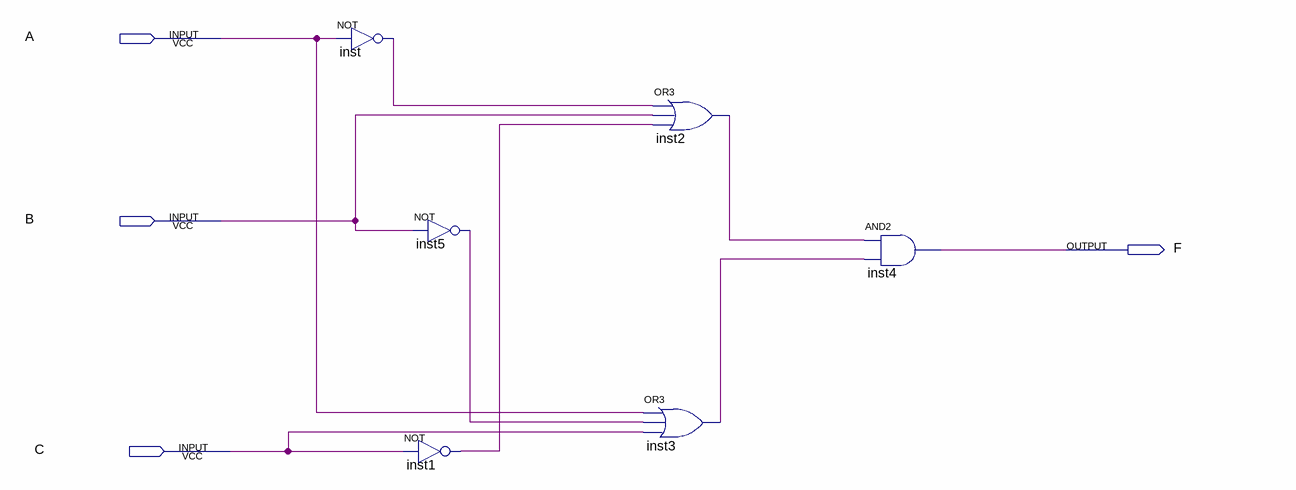
[diagram p0: schematic sheet]
// Quartus schematic lab3step0.bdf as structural Verilog: 6 symbols, 4 pins
module lab3step0 (
  input  A,
  input  B,
  input  C,
  output F
);

  wire inst1_out, inst2_out, inst3_out, inst5_out, inst_out;

  not inst (inst_out, A);
  not inst5 (inst5_out, B);
  not inst1 (inst1_out, C);
  or inst2 (inst2_out, inst_out, B, inst1_out);
  or inst3 (inst3_out, A, inst5_out, C);
  and inst4 (F, inst2_out, inst3_out);
endmodule
